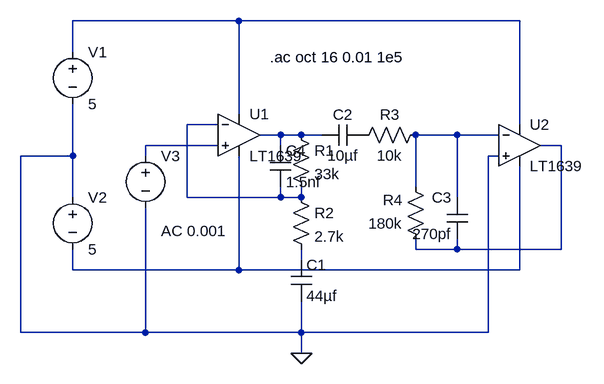
[diagram p0: schematic stage4_1.asc]
stage4_1.asc, the LTspice schematic file:
Version 4
SHEET 1 880 680
WIRE 160 -16 -96 -16
WIRE 592 -16 160 -16
WIRE -96 32 -96 -16
WIRE 160 128 160 -16
WIRE 128 144 80 144
WIRE 592 144 592 -16
WIRE 224 160 192 160
WIRE 256 160 224 160
WIRE 288 160 256 160
WIRE 496 160 432 160
WIRE 560 160 496 160
WIRE 128 176 16 176
WIRE 224 176 224 160
WIRE 656 176 624 176
WIRE -96 192 -96 112
WIRE -96 192 -176 192
WIRE 16 192 16 176
WIRE 560 192 544 192
WIRE 432 240 432 160
WIRE -96 256 -96 192
WIRE 80 256 80 144
WIRE 224 256 224 240
WIRE 224 256 80 256
WIRE 256 256 256 240
WIRE 256 256 224 256
WIRE 496 256 496 160
WIRE 432 336 432 320
WIRE 496 336 496 320
WIRE 496 336 432 336
WIRE 656 336 656 176
WIRE 656 336 496 336
WIRE 256 352 256 336
WIRE -96 368 -96 336
WIRE 160 368 160 192
WIRE 160 368 -96 368
WIRE 592 368 592 208
WIRE 592 368 160 368
WIRE -176 464 -176 192
WIRE 16 464 16 272
WIRE 16 464 -176 464
WIRE 256 464 256 416
WIRE 256 464 16 464
WIRE 544 464 544 192
WIRE 544 464 256 464
WIRE 256 496 256 464
FLAG 256 496 0
SYMBOL res 240 144 R0
SYMATTR InstName R1
SYMATTR Value 33k
SYMBOL res 240 240 R0
SYMATTR InstName R2
SYMATTR Value 2.7k
SYMBOL res 448 144 R90
WINDOW 0 0 56 VBottom 0
WINDOW 3 32 56 VTop 0
SYMATTR InstName R3
SYMATTR Value 10k
SYMBOL res 448 336 R180
WINDOW 0 36 76 Left 0
WINDOW 3 36 40 Left 0
SYMATTR InstName R4
SYMATTR Value 180k
SYMBOL cap 240 352 R0
SYMATTR InstName C1
SYMATTR Value 44µf
SYMBOL cap 352 144 R90
WINDOW 0 0 32 VBottom 0
WINDOW 3 32 32 VTop 0
SYMATTR InstName C2
SYMATTR Value 10µf
SYMBOL cap 512 320 R180
WINDOW 0 24 64 Left 0
WINDOW 3 24 8 Left 0
SYMATTR InstName C3
SYMATTR Value 270pf
SYMBOL voltage -96 16 R0
WINDOW 123 0 0 Left 0
WINDOW 39 0 0 Left 0
SYMATTR InstName V1
SYMATTR Value 5
SYMBOL voltage -96 240 R0
WINDOW 123 0 0 Left 0
WINDOW 39 0 0 Left 0
SYMATTR InstName V2
SYMATTR Value 5
SYMBOL voltage 16 176 R0
WINDOW 123 24 132 Left 0
WINDOW 39 0 0 Left 0
SYMATTR InstName V3
SYMATTR Value ""
SYMATTR Value2 AC 0.001
SYMBOL cap 208 176 R0
SYMATTR InstName C4
SYMATTR Value 1.5nf
SYMBOL Opamps\\LT1639 160 96 R0
SYMATTR InstName U1
SYMBOL Opamps\\LT1639 592 112 R0
SYMATTR InstName U2
TEXT 208 40 Left 0 !.ac oct 16 0.01 1e5

The netlist it stands for:
* stage4_1.asc
R1 N003 N002 33k
R2 N002 N007 2.7k
R3 N004 P001 10k
R4 N006 N004 180k
C1 N007 0 44µf
C2 P001 N003 10µf
C3 N006 N004 270pf
V1 N001 0 5
V2 0 N008 5
V3 N005 0 AC 0.001
C4 N003 N002 1.5nf
XU1 N005 N002 N001 N008 N003 LT1639  ; pins In+ In- V+ V- OUT
XU2 0 N004 N001 N008 N006 LT1639  ; pins In+ In- V+ V- OUT
.ac oct 16 0.01 1e5
.backanno
.end